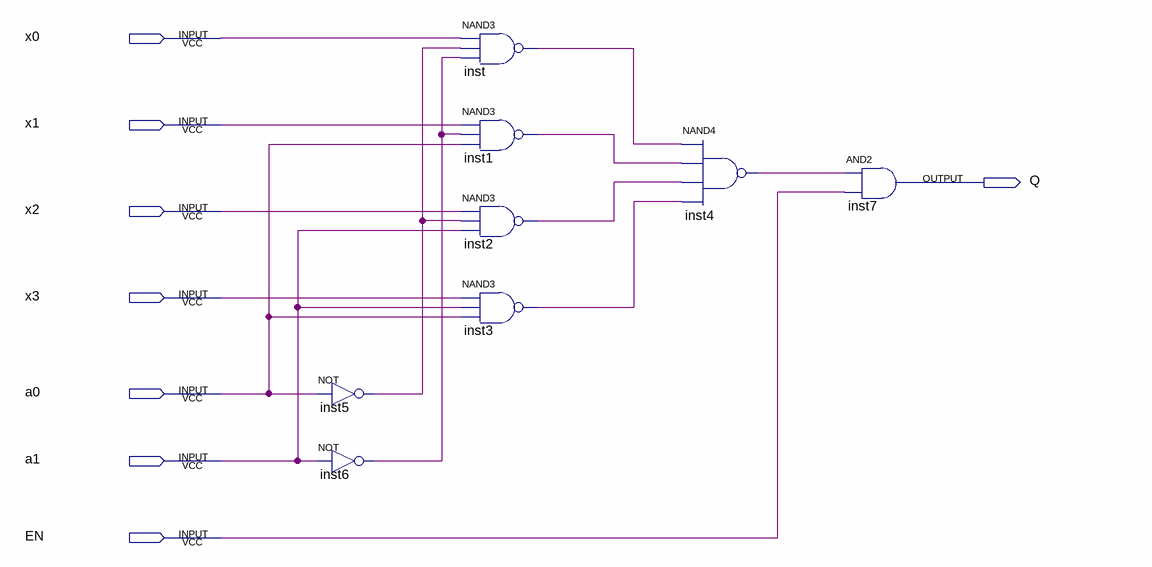
[diagram p0: schematic sheet]
// Quartus schematic mux4_1gr.bdf as structural Verilog: 8 symbols, 8 pins
module mux4_1gr (
  input  x0,
  input  x1,
  input  x2,
  input  x3,
  input  a0,
  input  a1,
  input  EN,
  output Q
);

  wire inst1_out, inst2_out, inst3_out, inst4_out, inst5_out, inst6_out, inst_out;

  not inst5 (inst5_out, a0);
  not inst6 (inst6_out, a1);
  nand inst (inst_out, x0, inst5_out, inst6_out);
  nand inst1 (inst1_out, x1, inst6_out, a0);
  nand inst2 (inst2_out, x2, inst5_out, a1);
  nand inst3 (inst3_out, x3, a1, a0);
  nand inst4 (inst4_out, inst_out, inst1_out, inst2_out, inst3_out);
  and inst7 (Q, inst4_out, EN);
endmodule
